# Altium schematic sheet sensor.SchDoc
size A4
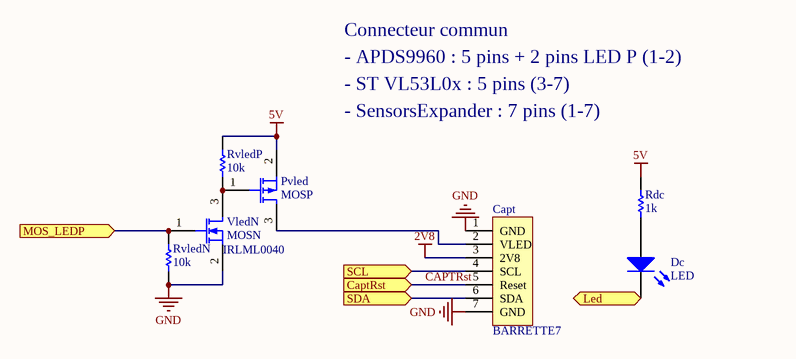
[diagram p0: sensor.SchDoc]

## Parts
Capt  BARRETTE7  [MOLEX7_2.50MM]
Dc  LED  [LED_0805]
Pvled  MOSP  [SOT23-3N]
Rdc  1k  [R1206_N]
RvledN  10k  [R1206_N]
RvledP  10k  [R1206_N]
VledN  MOSN  [SOT23-3N]

## Ports
CaptRst (in), Led (in), MOS_LEDP (in), SCL (in), SDA (in)

## Nets
2V8: Capt.3(2V8)
5V: Pvled.2(S) Rdc.1 RvledP.1
GND: Capt.1(GND) Capt.7(GND) RvledN.2 VledN.2(S)
CAPTRst: Capt.5(Reset) ; port CaptRst
Led: Dc.2(K) ; port Led
MOS_LEDP: RvledN.1 VledN.1(G) ; port MOS_LEDP
SCL: Capt.4(SCL) ; port SCL
SDA: Capt.6(SDA) ; port SDA
NetCapt_2: Capt.2(VLED) Pvled.3(D)
NetDc_1: Dc.1(A) Rdc.2
NetPvled_1: Pvled.1(G) RvledP.2 VledN.3(D)

## Notes on the sheet
- Connecteur commun
- - APDS9960 : 5 pins + 2 pins LED P (1-2)
- - ST VL53L0x : 5 pins (3-7)
- - SensorsExpander : 7 pins (1-7)
- (in symbol Transistor MOSFET-N) IRLML0040

## Library data of the parts
Capt = BARRETTE7: Header, 6-Pin; LatestRevisionDate: 17-Jul-2002; LatestRevisionNote: Re-released for DXP Platform.; Publisher: Altium Limited
Dc = LED: Typical LED; Published: 8-Jun-2000; LatestRevisionDate: 08-Jul-2005; LatestRevisionNote: Mech Layer 1 removed.; PackageReference: LED-1; Publisher: Altium Limited
Pvled = Transistor MOSFET-P: P-Channel MOSFET; PackageDocument: 1995/1996; Published: 8-Jun-2000; LatestRevisionDate: 17-Jul-2002; LatestRevisionNote: Re-released for DXP Platform.; PackageReference: E3; Publisher: Altium Limited
Rdc RvledN RvledP = Resistor: Published: 8-Jun-2000; LatestRevisionDate: 17-Jul-2002; LatestRevisionNote: Re-released for DXP Platform.; PackageReference: AXIAL-0.5; Publisher: Altium Limited
VledN = Transistor MOSFET-N: N-Channel MOSFET; PackageDocument: 1995/1996; Published: 8-Jun-2000; LatestRevisionDate: 17-Jul-2002; LatestRevisionNote: Re-released for DXP Platform.; PackageReference: E3; Publisher: Altium Limited